# EAGLE schematic dw08aRev2 (EAGLE 6.6.0)

## Sheet 1 of 6
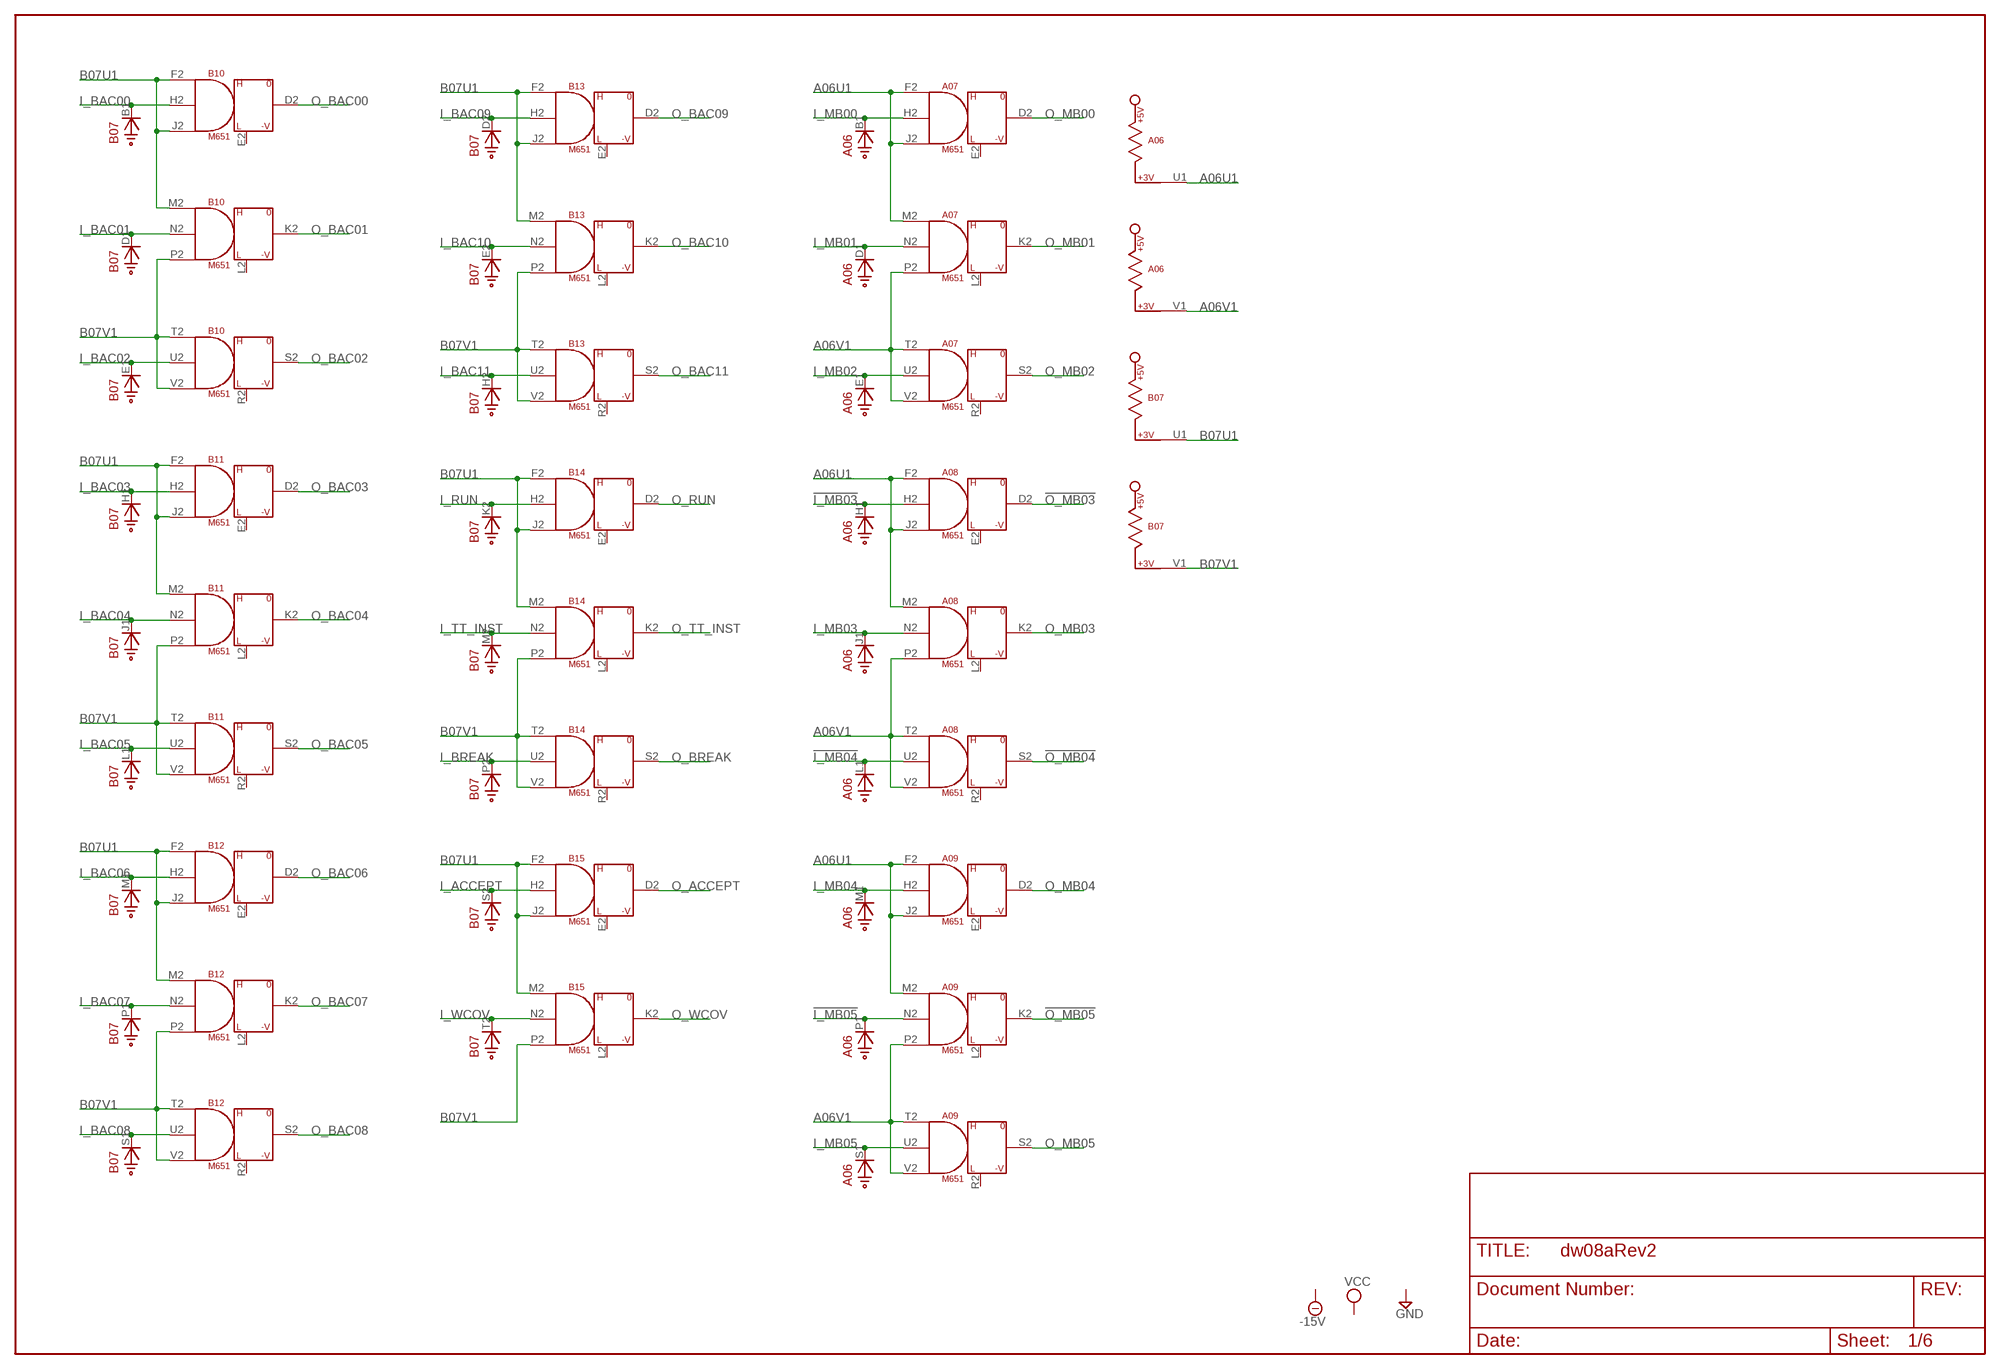
[diagram p0: schematic, sheet 1]

### Parts
A06  M907  [H807]
A07  M651  [H807]
A08  M651  [H807]
A09  M651  [H807]
B07  M907  [H807]
B10  M651  [H807]
B11  M651  [H807]
B12  M651  [H807]
B13  M651  [H807]
B14  M651  [H807]
B15  M651  [H807]

### Nets
!I_MB03: A06.H1(H1:CATHODE) A08.H2(D:IN2) ; also sheet 6
!I_MB04: A06.L1(L1:CATHODE) A08.U2(S:IN2) ; also sheet 6
!I_MB05: A06.P1(P1:CATHODE) A09.N2(K:IN2) ; also sheet 6
!O_MB03: A08.D2(D:OUT) ; also sheet 5
!O_MB04: A08.S2(S:OUT) ; also sheet 5
!O_MB05: A09.K2(K:OUT) ; also sheet 5
A06U1: A06.U1 A07.F2(D:IN1) A07.J2(D:IN3) A07.M2(K:IN1) A08.F2(D:IN1) A08.J2(D:IN3) A08.M2(K:IN1) A09.F2(D:IN1) A09.J2(D:IN3) A09.M2(K:IN1) ; also sheet 2
A06V1: A06.V1 A07.P2(K:IN3) A07.T2(S:IN1) A07.V2(S:IN3) A08.P2(K:IN3) A08.T2(S:IN1) A08.V2(S:IN3) A09.P2(K:IN3) A09.T2(S:IN1) A09.V2(S:IN3) ; also sheet 2
B07U1: B07.U1 B10.F2(D:IN1) B10.J2(D:IN3) B10.M2(K:IN1) B11.F2(D:IN1) B11.J2(D:IN3) B11.M2(K:IN1) B12.F2(D:IN1) B12.J2(D:IN3) B12.M2(K:IN1) B13.F2(D:IN1) B13.J2(D:IN3) B13.M2(K:IN1) B14.F2(D:IN1) B14.J2(D:IN3) B14.M2(K:IN1) B15.F2(D:IN1) B15.J2(D:IN3) B15.M2(K:IN1) ; also sheet 2
B07V1: B07.V1 B10.P2(K:IN3) B10.T2(S:IN1) B10.V2(S:IN3) B11.P2(K:IN3) B11.T2(S:IN1) B11.V2(S:IN3) B12.P2(K:IN3) B12.T2(S:IN1) B12.V2(S:IN3) B13.P2(K:IN3) B13.T2(S:IN1) B13.V2(S:IN3) B14.P2(K:IN3) B14.T2(S:IN1) B14.V2(S:IN3) B15.P2(K:IN3)
I_ACCEPT: B07.S2(S2:CATHODE) B15.H2(D:IN2) ; also sheet 6
I_BAC00: B07.B1(B1:CATHODE) B10.H2(D:IN2) ; also sheet 6
I_BAC01: B07.D1(D1:CATHODE) B10.N2(K:IN2) ; also sheet 6
I_BAC02: B07.E1(E1:CATHODE) B10.U2(S:IN2) ; also sheet 6
I_BAC03: B07.H1(H1:CATHODE) B11.H2(D:IN2) ; also sheet 6
I_BAC04: B07.J1(J1:CATHODE) B11.N2(K:IN2) ; also sheet 6
I_BAC05: B07.L1(L1:CATHODE) B11.U2(S:IN2) ; also sheet 6
I_BAC06: B07.M1(M1:CATHODE) B12.H2(D:IN2) ; also sheet 6
I_BAC07: B07.P1(P1:CATHODE) B12.N2(K:IN2) ; also sheet 6
I_BAC08: B07.S1(S1:CATHODE) B12.U2(S:IN2) ; also sheet 6
I_BAC09: B07.D2(D2:CATHODE) B13.H2(D:IN2) ; also sheet 6
I_BAC10: B07.E2(E2:CATHODE) B13.N2(K:IN2) ; also sheet 6
I_BAC11: B07.H2(H2:CATHODE) B13.U2(S:IN2) ; also sheet 6
I_BREAK: B07.P2(P2:CATHODE) B14.U2(S:IN2) ; also sheet 4,6
I_MB00: A06.B1(B1:CATHODE) A07.H2(D:IN2) ; also sheet 6
I_MB01: A06.D1(D1:CATHODE) A07.N2(K:IN2) ; also sheet 6
I_MB02: A06.E1(E1:CATHODE) A07.U2(S:IN2) ; also sheet 6
I_MB03: A06.J1(J1:CATHODE) A08.N2(K:IN2) ; also sheet 6
I_MB04: A06.M1(M1:CATHODE) A09.H2(D:IN2) ; also sheet 6
I_MB05: A06.S1(S1:CATHODE) A09.U2(S:IN2) ; also sheet 6
I_RUN: B07.K2(K2:CATHODE) B14.H2(D:IN2) ; also sheet 6
I_TT_INST: B07.M2(M2:CATHODE) B14.N2(K:IN2) ; also sheet 6
I_WCOV: B07.T2(T2:CATHODE) B15.N2(K:IN2) ; also sheet 6
O_ACCEPT: B15.D2(D:OUT) ; also sheet 5
O_BAC00: B10.D2(D:OUT) ; also sheet 5
O_BAC01: B10.K2(K:OUT) ; also sheet 5
O_BAC02: B10.S2(S:OUT) ; also sheet 5
O_BAC03: B11.D2(D:OUT) ; also sheet 5
O_BAC04: B11.K2(K:OUT) ; also sheet 5
O_BAC05: B11.S2(S:OUT) ; also sheet 5
O_BAC06: B12.D2(D:OUT) ; also sheet 5
O_BAC07: B12.K2(K:OUT) ; also sheet 5
O_BAC08: B12.S2(S:OUT) ; also sheet 5
O_BAC09: B13.D2(D:OUT) ; also sheet 5
O_BAC10: B13.K2(K:OUT) ; also sheet 5
O_BAC11: B13.S2(S:OUT) ; also sheet 5
O_BREAK: B14.S2(S:OUT) ; also sheet 5
O_MB00: A07.D2(D:OUT) ; also sheet 5
O_MB01: A07.K2(K:OUT) ; also sheet 5
O_MB02: A07.S2(S:OUT) ; also sheet 5
O_MB03: A08.K2(K:OUT) ; also sheet 5
O_MB04: A09.D2(D:OUT) ; also sheet 5
O_MB05: A09.S2(S:OUT) ; also sheet 5
O_RUN: B14.D2(D:OUT) ; also sheet 5
O_TT_INST: B14.K2(K:OUT) ; also sheet 5
O_WCOV: B15.K2(K:OUT) ; also sheet 5
Unconnected: A07.E2(D:SLOW) A07.L2(K:SLOW) A07.R2(S:SLOW) A08.E2(D:SLOW) A08.L2(K:SLOW) A08.R2(S:SLOW) A09.E2(D:SLOW) A09.L2(K:SLOW) A09.R2(S:SLOW) B07.V2(V2:CATHODE) B10.E2(D:SLOW) B10.L2(K:SLOW) B10.R2(S:SLOW) B11.E2(D:SLOW) B11.L2(K:SLOW) B11.R2(S:SLOW) B12.E2(D:SLOW) B12.L2(K:SLOW) B12.R2(S:SLOW) B13.E2(D:SLOW) B13.L2(K:SLOW) B13.R2(S:SLOW) B14.E2(D:SLOW) B14.L2(K:SLOW) B14.R2(S:SLOW) B15.E2(D:SLOW) B15.L2(K:SLOW) B15.R2(S:SLOW) B15.S2(S:OUT) B15.T2(S:IN1) B15.U2(S:IN2) B15.V2(S:IN3)

## Sheet 2 of 6
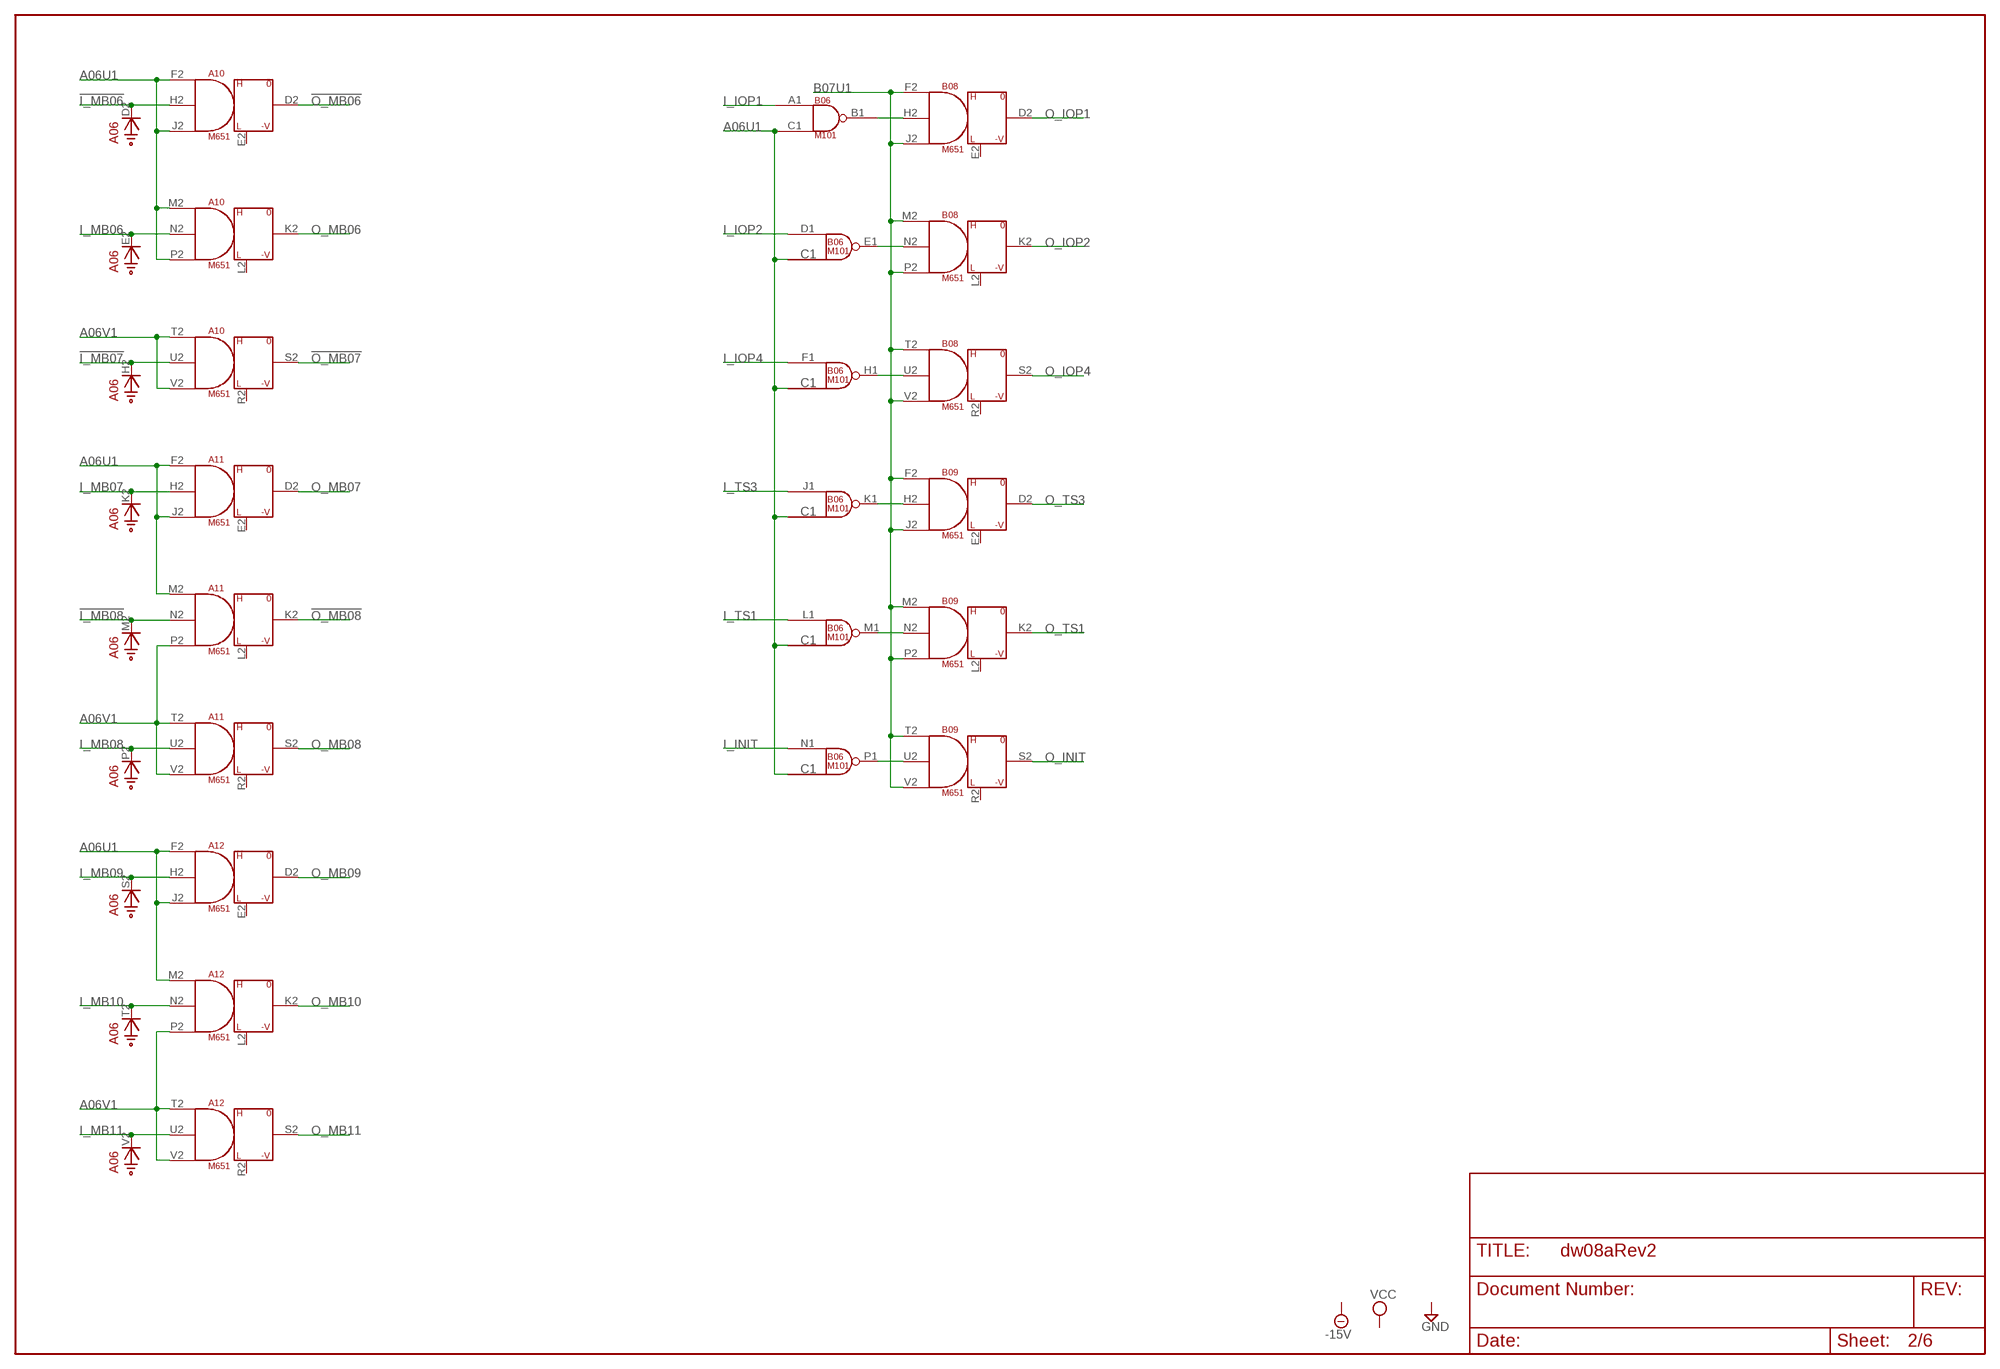
[diagram p1: schematic, sheet 2]

### Parts
A10  M651  [H807]
A11  M651  [H807]
A12  M651  [H807]
B06  M101  [H807]
B08  M651  [H807]
B09  M651  [H807]

### Nets
!I_MB06: A06.D2(D2:CATHODE) A10.H2(D:IN2) ; also sheet 6
!I_MB07: A06.H2(H2:CATHODE) A10.U2(S:IN2) ; also sheet 6
!I_MB08: A06.M2(M2:CATHODE) A11.N2(K:IN2) ; also sheet 6
!O_MB06: A10.D2(D:OUT) ; also sheet 5
!O_MB07: A10.S2(S:OUT) ; also sheet 5
!O_MB08: A11.K2(K:OUT) ; also sheet 5
A06U1: A10.F2(D:IN1) A10.J2(D:IN3) A10.M2(K:IN1) A10.P2(K:IN3) A11.F2(D:IN1) A11.J2(D:IN3) A11.M2(K:IN1) A12.F2(D:IN1) A12.J2(D:IN3) A12.M2(K:IN1) B06.C1(B1:IN2) ; also sheet 1
A06V1: A10.T2(S:IN1) A10.V2(S:IN3) A11.P2(K:IN3) A11.T2(S:IN1) A11.V2(S:IN3) A12.P2(K:IN3) A12.T2(S:IN1) A12.V2(S:IN3) ; also sheet 1
B07U1: B08.F2(D:IN1) B08.J2(D:IN3) B08.M2(K:IN1) B08.P2(K:IN3) B08.T2(S:IN1) B08.V2(S:IN3) B09.F2(D:IN1) B09.J2(D:IN3) B09.M2(K:IN1) B09.P2(K:IN3) B09.T2(S:IN1) B09.V2(S:IN3) ; also sheet 1
I_INIT: B06.N1(P1:IN) ; also sheet 6
I_IOP1: B06.A1(B1:IN1) ; also sheet 6
I_IOP2: B06.D1(E1:IN) ; also sheet 6
I_IOP4: B06.F1(H1:IN) ; also sheet 6
I_MB06: A06.E2(E2:CATHODE) A10.N2(K:IN2) ; also sheet 6
I_MB07: A06.K2(K2:CATHODE) A11.H2(D:IN2) ; also sheet 6
I_MB08: A06.P2(P2:CATHODE) A11.U2(S:IN2) ; also sheet 6
I_MB09: A06.S2(S2:CATHODE) A12.H2(D:IN2) ; also sheet 6
I_MB10: A06.T2(T2:CATHODE) A12.N2(K:IN2) ; also sheet 6
I_MB11: A06.V2(V2:CATHODE) A12.U2(S:IN2) ; also sheet 6
I_TS1: B06.L1(M1:IN) ; also sheet 6
I_TS3: B06.J1(K1:IN) ; also sheet 6
N$1: B06.B1(B1:OUT) B08.H2(D:IN2)
N$2: B06.E1(E1:OUT) B08.N2(K:IN2)
N$3: B06.H1(H1:OUT) B08.U2(S:IN2)
N$4: B06.K1(K1:OUT) B09.H2(D:IN2)
N$5: B06.M1(M1:OUT) B09.N2(K:IN2)
N$6: B06.P1(P1:OUT) B09.U2(S:IN2)
O_INIT: B09.S2(S:OUT) ; also sheet 5
O_IOP1: B08.D2(D:OUT) ; also sheet 5
O_IOP2: B08.K2(K:OUT) ; also sheet 5
O_IOP4: B08.S2(S:OUT) ; also sheet 5
O_MB06: A10.K2(K:OUT) ; also sheet 5
O_MB07: A11.D2(D:OUT) ; also sheet 5
O_MB08: A11.S2(S:OUT) ; also sheet 5
O_MB09: A12.D2(D:OUT) ; also sheet 5
O_MB10: A12.K2(K:OUT) ; also sheet 5
O_MB11: A12.S2(S:OUT) ; also sheet 5
O_TS1: B09.K2(K:OUT) ; also sheet 5
O_TS3: B09.D2(D:OUT) ; also sheet 5
Unconnected: A10.E2(D:SLOW) A10.L2(K:SLOW) A10.R2(S:SLOW) A11.E2(D:SLOW) A11.L2(K:SLOW) A11.R2(S:SLOW) A12.E2(D:SLOW) A12.L2(K:SLOW) A12.R2(S:SLOW) B06.E2(F2:IN) B06.F2(F2:OUT) B06.H2(J2:IN) B06.J2(J2:OUT) B06.K2(L2:IN) B06.L2(L2:OUT) B06.M2(N2:IN) B06.N2(N2:OUT) B06.P2(R2:IN) B06.R1(S1:IN) B06.R2(R2:OUT) B06.S1(S1:OUT) B06.S2(T2:IN) B06.T2(T2:OUT) B06.U1(U1:OUT) B06.U2(V2:IN) B06.V1(U1:IN) B06.V2(V2:OUT) B08.E2(D:SLOW) B08.L2(K:SLOW) B08.R2(S:SLOW) B09.E2(D:SLOW) B09.L2(K:SLOW) B09.R2(S:SLOW)

## Sheet 3 of 6
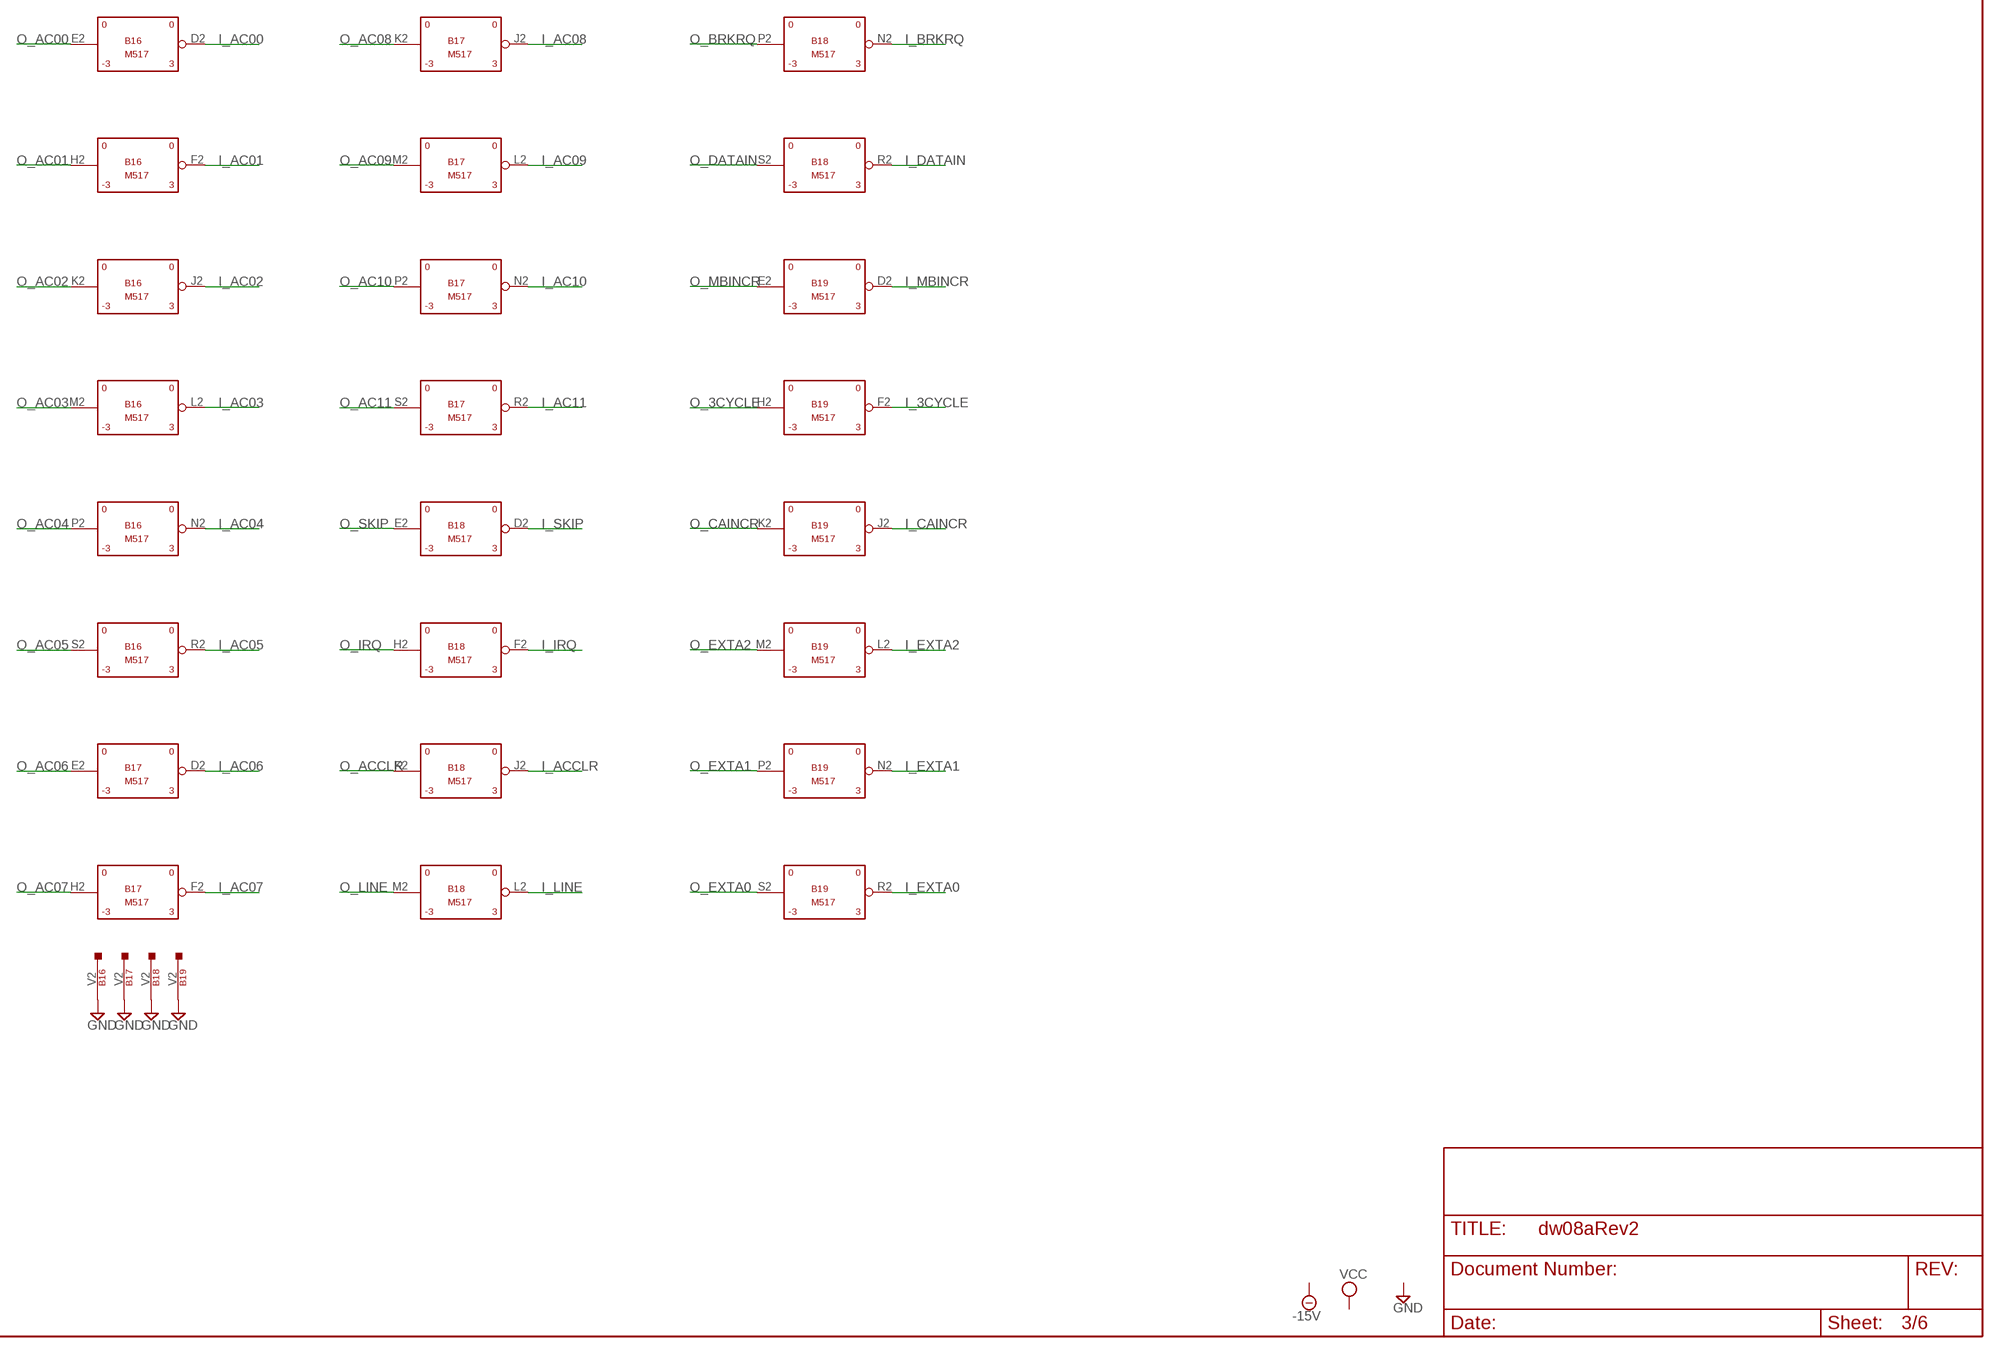
[diagram p2: schematic, sheet 3]

### Parts
B16  M517  [H807]
B17  M517  [H807]
B18  M517  [H807]
B19  M517  [H807]

### Nets
GND [supply]: B16.V2 B17.V2 B18.V2 B19.V2 ; also sheet 4
I_3CYCLE: B19.F2(F:OUT) ; also sheet 6
I_AC00: B16.D2(D:OUT) ; also sheet 6
I_AC01: B16.F2(F:OUT) ; also sheet 6
I_AC02: B16.J2(J:OUT) ; also sheet 6
I_AC03: B16.L2(L:OUT) ; also sheet 6
I_AC04: B16.N2(N:OUT) ; also sheet 6
I_AC05: B16.R2(R:OUT) ; also sheet 6
I_AC06: B17.D2(D:OUT) ; also sheet 6
I_AC07: B17.F2(F:OUT) ; also sheet 6
I_AC08: B17.J2(J:OUT) ; also sheet 6
I_AC09: B17.L2(L:OUT) ; also sheet 6
I_AC10: B17.N2(N:OUT) ; also sheet 6
I_AC11: B17.R2(R:OUT) ; also sheet 6
I_ACCLR: B18.J2(J:OUT) ; also sheet 6
I_BRKRQ: B18.N2(N:OUT) ; also sheet 6
I_CAINCR: B19.J2(J:OUT) ; also sheet 6
I_DATAIN: B18.R2(R:OUT) ; also sheet 6
I_EXTA0: B19.R2(R:OUT) ; also sheet 6
I_EXTA1: B19.N2(N:OUT) ; also sheet 6
I_EXTA2: B19.L2(L:OUT) ; also sheet 6
I_IRQ: B18.F2(F:OUT) ; also sheet 6
I_LINE: B18.L2(L:OUT) ; also sheet 6
I_MBINCR: B19.D2(D:OUT) ; also sheet 6
I_SKIP: B18.D2(D:OUT) ; also sheet 6
O_3CYCLE: B19.H2(F:IN) ; also sheet 5
O_AC00: B16.E2(D:IN) ; also sheet 5
O_AC01: B16.H2(F:IN) ; also sheet 5
O_AC02: B16.K2(J:IN) ; also sheet 5
O_AC03: B16.M2(L:IN) ; also sheet 5
O_AC04: B16.P2(N:IN) ; also sheet 5
O_AC05: B16.S2(R:IN) ; also sheet 5
O_AC06: B17.E2(D:IN) ; also sheet 5
O_AC07: B17.H2(F:IN) ; also sheet 5
O_AC08: B17.K2(J:IN) ; also sheet 5
O_AC09: B17.M2(L:IN) ; also sheet 5
O_AC10: B17.P2(N:IN) ; also sheet 5
O_AC11: B17.S2(R:IN) ; also sheet 5
O_ACCLR: B18.K2(J:IN) ; also sheet 5
O_BRKRQ: B18.P2(N:IN) ; also sheet 5
O_CAINCR: B19.K2(J:IN) ; also sheet 5
O_DATAIN: B18.S2(R:IN) ; also sheet 5
O_EXTA0: B19.S2(R:IN) ; also sheet 5
O_EXTA1: B19.P2(N:IN) ; also sheet 5
O_EXTA2: B19.M2(L:IN) ; also sheet 5
O_IRQ: B18.H2(F:IN) ; also sheet 5
O_LINE: B18.M2(L:IN) ; also sheet 5
O_MBINCR: B19.E2(D:IN) ; also sheet 5
O_SKIP: B18.E2(D:IN) ; also sheet 5

## Sheet 4 of 6
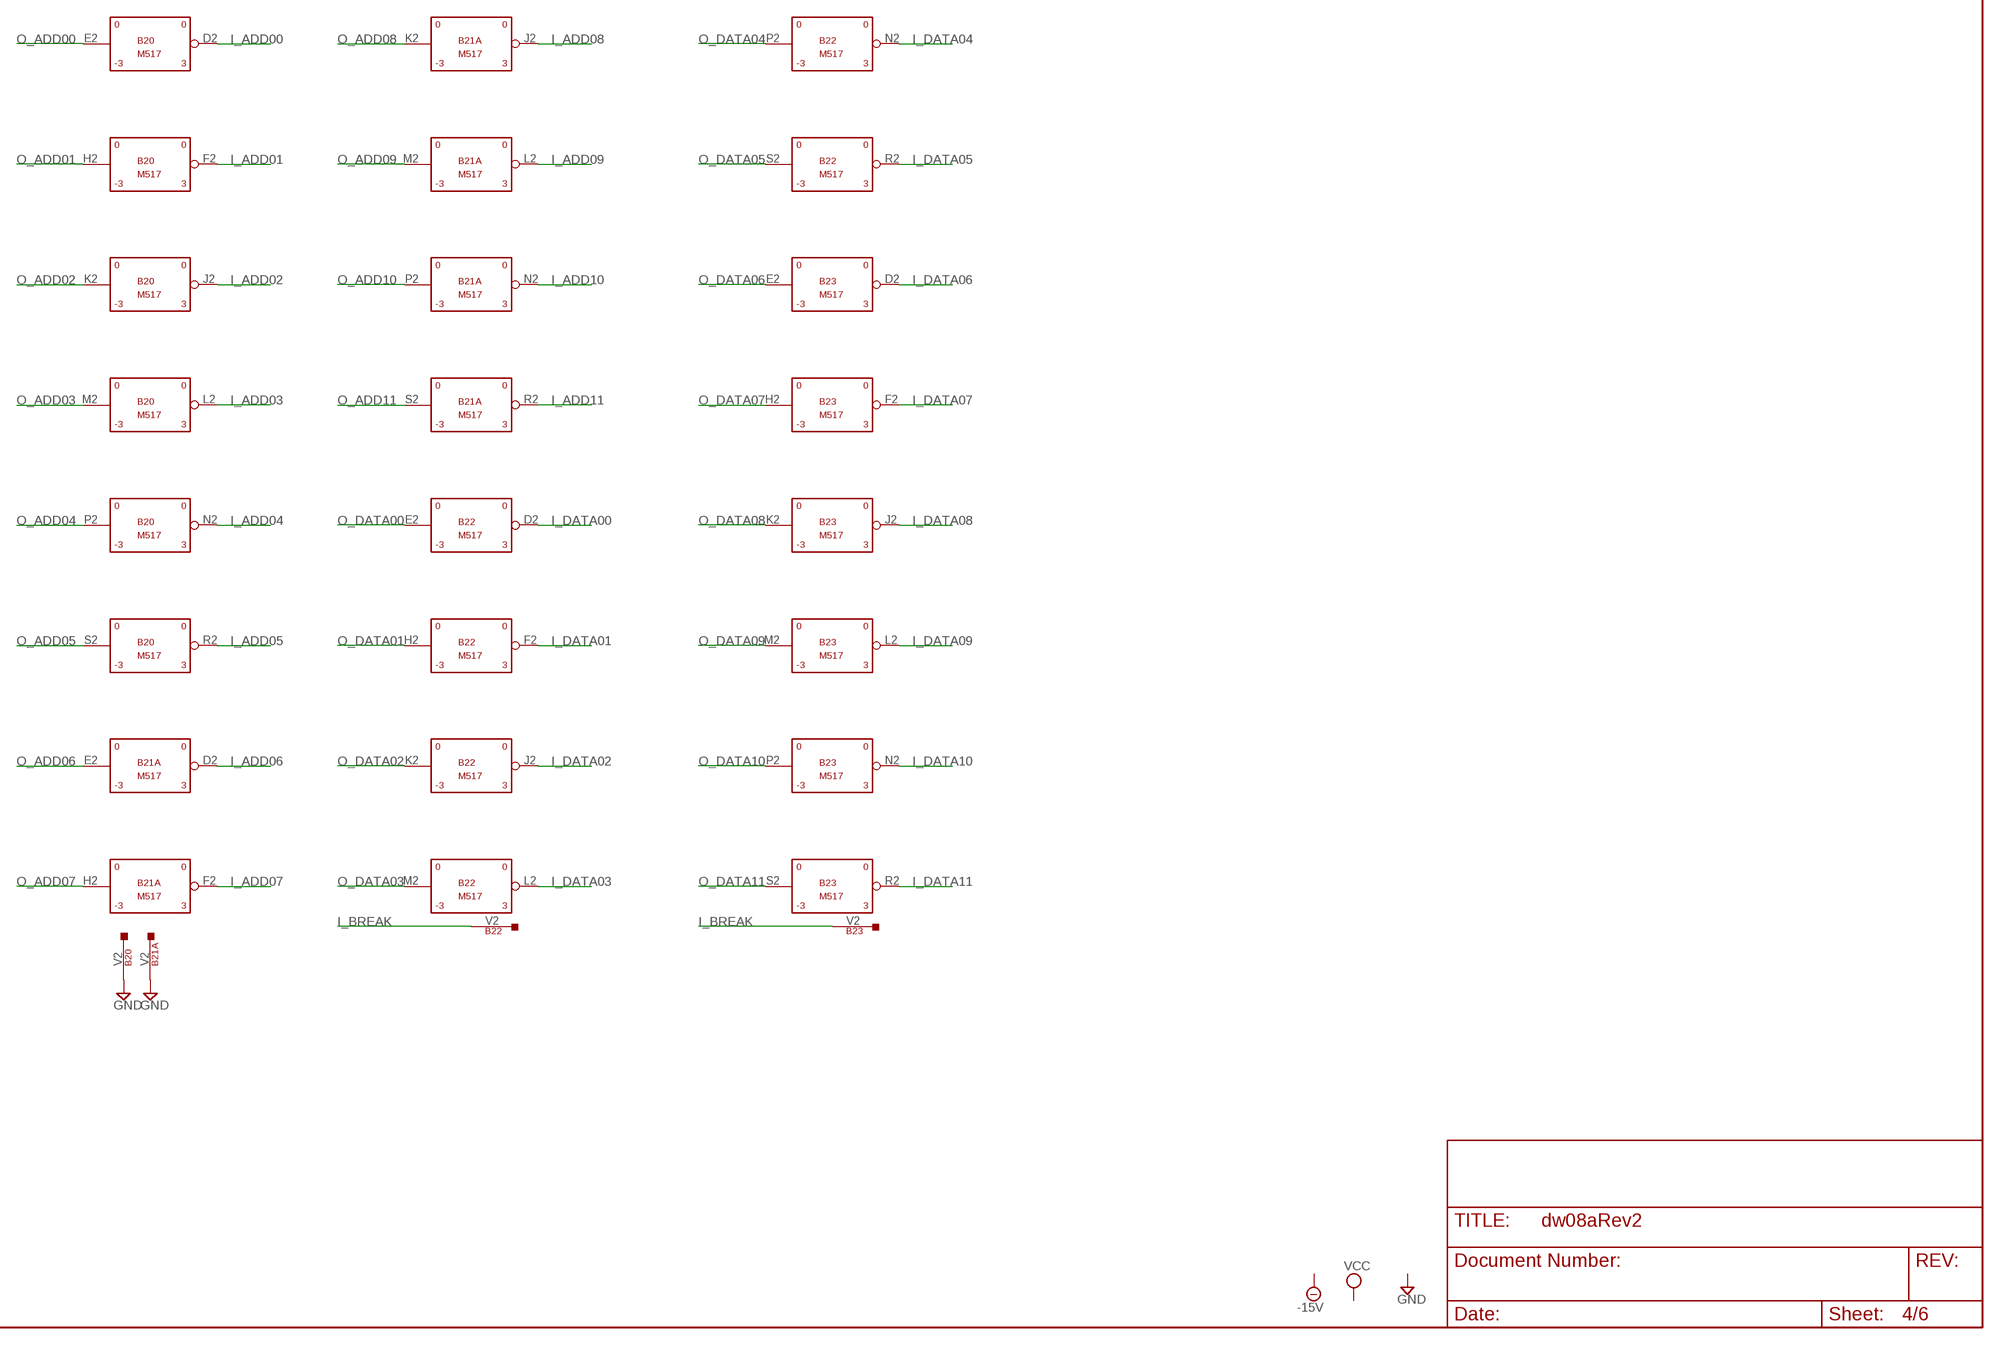
[diagram p3: schematic, sheet 4]

### Parts
B20  M517  [H807]
B21A  M517  [H807]
B22  M517  [H807]
B23  M517  [H807]

### Nets
GND [supply]: B20.V2 B21A.V2 ; also sheet 3
I_ADD00: B20.D2(D:OUT) ; also sheet 6
I_ADD01: B20.F2(F:OUT) ; also sheet 6
I_ADD02: B20.J2(J:OUT) ; also sheet 6
I_ADD03: B20.L2(L:OUT) ; also sheet 6
I_ADD04: B20.N2(N:OUT) ; also sheet 6
I_ADD05: B20.R2(R:OUT) ; also sheet 6
I_ADD06: B21A.D2(D:OUT) ; also sheet 6
I_ADD07: B21A.F2(F:OUT) ; also sheet 6
I_ADD08: B21A.J2(J:OUT) ; also sheet 6
I_ADD09: B21A.L2(L:OUT) ; also sheet 6
I_ADD10: B21A.N2(N:OUT) ; also sheet 6
I_ADD11: B21A.R2(R:OUT) ; also sheet 6
I_BREAK: B22.V2 B23.V2 ; also sheet 1,6
I_DATA00: B22.D2(D:OUT) ; also sheet 6
I_DATA01: B22.F2(F:OUT) ; also sheet 6
I_DATA02: B22.J2(J:OUT) ; also sheet 6
I_DATA03: B22.L2(L:OUT) ; also sheet 6
I_DATA04: B22.N2(N:OUT) ; also sheet 6
I_DATA05: B22.R2(R:OUT) ; also sheet 6
I_DATA06: B23.D2(D:OUT) ; also sheet 6
I_DATA07: B23.F2(F:OUT) ; also sheet 6
I_DATA08: B23.J2(J:OUT) ; also sheet 6
I_DATA09: B23.L2(L:OUT) ; also sheet 6
I_DATA10: B23.N2(N:OUT) ; also sheet 6
I_DATA11: B23.R2(R:OUT) ; also sheet 6
O_ADD00: B20.E2(D:IN) ; also sheet 5
O_ADD01: B20.H2(F:IN) ; also sheet 5
O_ADD02: B20.K2(J:IN) ; also sheet 5
O_ADD03: B20.M2(L:IN) ; also sheet 5
O_ADD04: B20.P2(N:IN) ; also sheet 5
O_ADD05: B20.S2(R:IN) ; also sheet 5
O_ADD06: B21A.E2(D:IN) ; also sheet 5
O_ADD07: B21A.H2(F:IN) ; also sheet 5
O_ADD08: B21A.K2(J:IN) ; also sheet 5
O_ADD09: B21A.M2(L:IN) ; also sheet 5
O_ADD10: B21A.P2(N:IN) ; also sheet 5
O_ADD11: B21A.S2(R:IN) ; also sheet 5
O_DATA00: B22.E2(D:IN) ; also sheet 5
O_DATA01: B22.H2(F:IN) ; also sheet 5
O_DATA02: B22.K2(J:IN) ; also sheet 5
O_DATA03: B22.M2(L:IN) ; also sheet 5
O_DATA04: B22.P2(N:IN) ; also sheet 5
O_DATA05: B22.S2(R:IN) ; also sheet 5
O_DATA06: B23.E2(D:IN) ; also sheet 5
O_DATA07: B23.H2(F:IN) ; also sheet 5
O_DATA08: B23.K2(J:IN) ; also sheet 5
O_DATA09: B23.M2(L:IN) ; also sheet 5
O_DATA10: B23.P2(N:IN) ; also sheet 5
O_DATA11: B23.S2(R:IN) ; also sheet 5

## Sheet 5 of 6
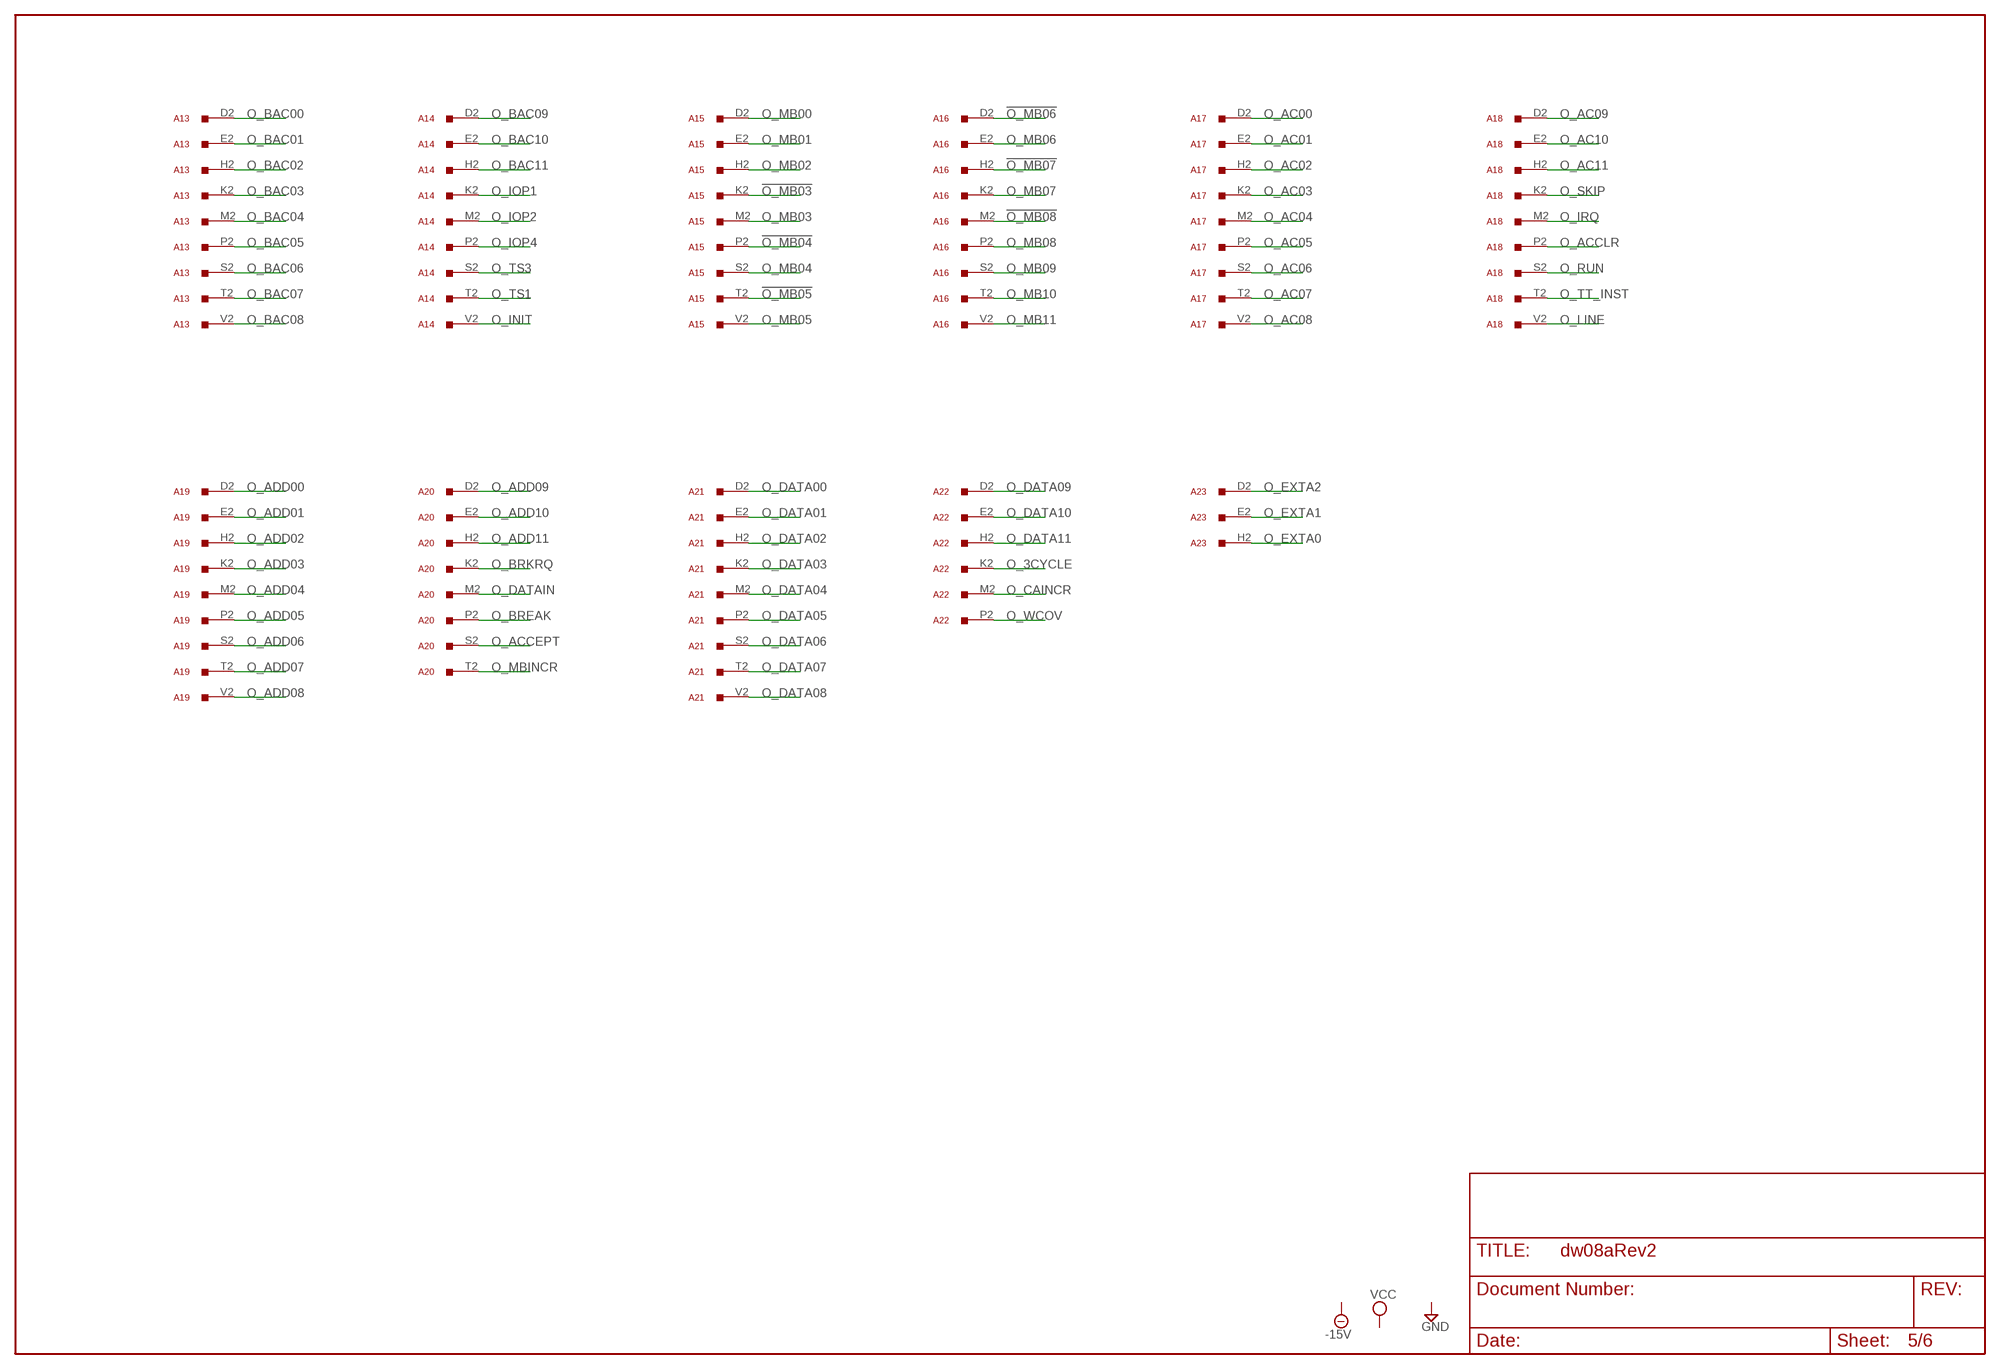
[diagram p4: schematic, sheet 5]

### Parts
A13  W011  [H807]
A14  W011  [H807]
A15  W011  [H807]
A16  W011  [H807]
A17  W011  [H807]
A18  W011  [H807]
A19  W011  [H807]
A20  W011  [H807]
A21  W011  [H807]
A22  W011  [H807]
A23  W011  [H807]

### Nets
!O_MB03: A15.K2 ; also sheet 1
!O_MB04: A15.P2 ; also sheet 1
!O_MB05: A15.T2 ; also sheet 1
!O_MB06: A16.D2 ; also sheet 2
!O_MB07: A16.H2 ; also sheet 2
!O_MB08: A16.M2 ; also sheet 2
O_3CYCLE: A22.K2 ; also sheet 3
O_AC00: A17.D2 ; also sheet 3
O_AC01: A17.E2 ; also sheet 3
O_AC02: A17.H2 ; also sheet 3
O_AC03: A17.K2 ; also sheet 3
O_AC04: A17.M2 ; also sheet 3
O_AC05: A17.P2 ; also sheet 3
O_AC06: A17.S2 ; also sheet 3
O_AC07: A17.T2 ; also sheet 3
O_AC08: A17.V2 ; also sheet 3
O_AC09: A18.D2 ; also sheet 3
O_AC10: A18.E2 ; also sheet 3
O_AC11: A18.H2 ; also sheet 3
O_ACCEPT: A20.S2 ; also sheet 1
O_ACCLR: A18.P2 ; also sheet 3
O_ADD00: A19.D2 ; also sheet 4
O_ADD01: A19.E2 ; also sheet 4
O_ADD02: A19.H2 ; also sheet 4
O_ADD03: A19.K2 ; also sheet 4
O_ADD04: A19.M2 ; also sheet 4
O_ADD05: A19.P2 ; also sheet 4
O_ADD06: A19.S2 ; also sheet 4
O_ADD07: A19.T2 ; also sheet 4
O_ADD08: A19.V2 ; also sheet 4
O_ADD09: A20.D2 ; also sheet 4
O_ADD10: A20.E2 ; also sheet 4
O_ADD11: A20.H2 ; also sheet 4
O_BAC00: A13.D2 ; also sheet 1
O_BAC01: A13.E2 ; also sheet 1
O_BAC02: A13.H2 ; also sheet 1
O_BAC03: A13.K2 ; also sheet 1
O_BAC04: A13.M2 ; also sheet 1
O_BAC05: A13.P2 ; also sheet 1
O_BAC06: A13.S2 ; also sheet 1
O_BAC07: A13.T2 ; also sheet 1
O_BAC08: A13.V2 ; also sheet 1
O_BAC09: A14.D2 ; also sheet 1
O_BAC10: A14.E2 ; also sheet 1
O_BAC11: A14.H2 ; also sheet 1
O_BREAK: A20.P2 ; also sheet 1
O_BRKRQ: A20.K2 ; also sheet 3
O_CAINCR: A22.M2 ; also sheet 3
O_DATA00: A21.D2 ; also sheet 4
O_DATA01: A21.E2 ; also sheet 4
O_DATA02: A21.H2 ; also sheet 4
O_DATA03: A21.K2 ; also sheet 4
O_DATA04: A21.M2 ; also sheet 4
O_DATA05: A21.P2 ; also sheet 4
O_DATA06: A21.S2 ; also sheet 4
O_DATA07: A21.T2 ; also sheet 4
O_DATA08: A21.V2 ; also sheet 4
O_DATA09: A22.D2 ; also sheet 4
O_DATA10: A22.E2 ; also sheet 4
O_DATA11: A22.H2 ; also sheet 4
O_DATAIN: A20.M2 ; also sheet 3
O_EXTA0: A23.H2 ; also sheet 3
O_EXTA1: A23.E2 ; also sheet 3
O_EXTA2: A23.D2 ; also sheet 3
O_INIT: A14.V2 ; also sheet 2
O_IOP1: A14.K2 ; also sheet 2
O_IOP2: A14.M2 ; also sheet 2
O_IOP4: A14.P2 ; also sheet 2
O_IRQ: A18.M2 ; also sheet 3
O_LINE: A18.V2 ; also sheet 3
O_MB00: A15.D2 ; also sheet 1
O_MB01: A15.E2 ; also sheet 1
O_MB02: A15.H2 ; also sheet 1
O_MB03: A15.M2 ; also sheet 1
O_MB04: A15.S2 ; also sheet 1
O_MB05: A15.V2 ; also sheet 1
O_MB06: A16.E2 ; also sheet 2
O_MB07: A16.K2 ; also sheet 2
O_MB08: A16.P2 ; also sheet 2
O_MB09: A16.S2 ; also sheet 2
O_MB10: A16.T2 ; also sheet 2
O_MB11: A16.V2 ; also sheet 2
O_MBINCR: A20.T2 ; also sheet 3
O_RUN: A18.S2 ; also sheet 1
O_SKIP: A18.K2 ; also sheet 3
O_TS1: A14.T2 ; also sheet 2
O_TS3: A14.S2 ; also sheet 2
O_TT_INST: A18.T2 ; also sheet 1
O_WCOV: A22.P2 ; also sheet 1
Unconnected: A20.V2 A22.S2 A22.T2 A22.V2 A23.K2 A23.M2 A23.P2 A23.S2 A23.T2 A23.V2

## Sheet 6 of 6
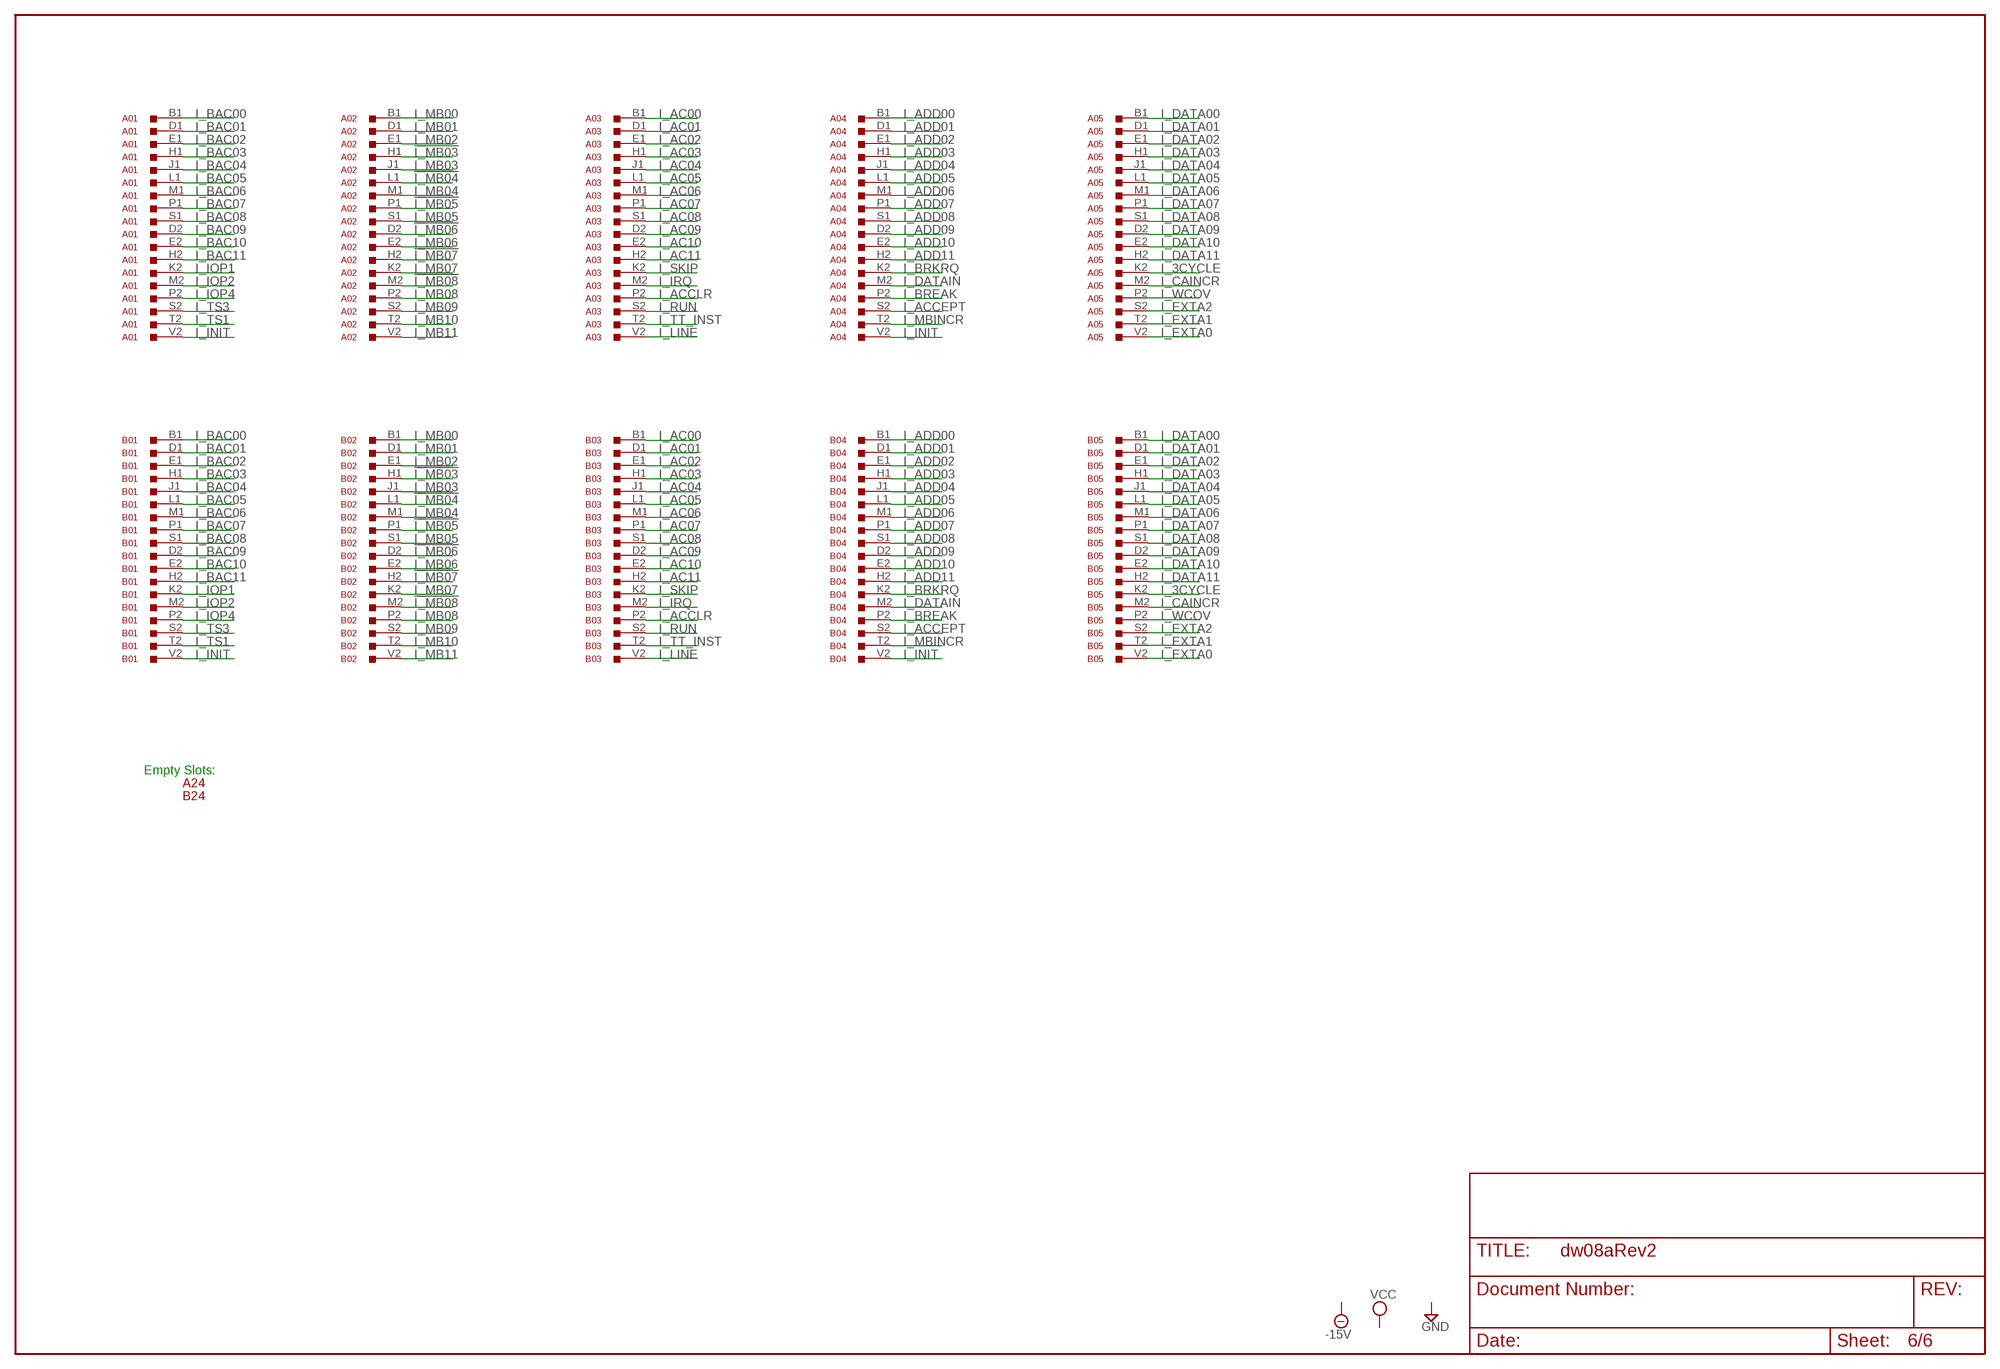
[diagram p5: schematic, sheet 6]

### Parts
A01  M903  [H807]
A02  M903  [H807]
A03  M903  [H807]
A04  M903  [H807]
A05  M903  [H807]
A24  H807  [H807]
B01  M903  [H807]
B02  M903  [H807]
B03  M903  [H807]
B04  M903  [H807]
B05  M903  [H807]
B24  H807  [H807]

### Nets
!I_MB03: A02.H1 B02.H1 ; also sheet 1
!I_MB04: A02.L1 B02.L1 ; also sheet 1
!I_MB05: A02.P1 B02.P1 ; also sheet 1
!I_MB06: A02.D2 B02.D2 ; also sheet 2
!I_MB07: A02.H2 B02.H2 ; also sheet 2
!I_MB08: A02.M2 B02.M2 ; also sheet 2
I_3CYCLE: A05.K2 B05.K2 ; also sheet 3
I_AC00: A03.B1 B03.B1 ; also sheet 3
I_AC01: A03.D1 B03.D1 ; also sheet 3
I_AC02: A03.E1 B03.E1 ; also sheet 3
I_AC03: A03.H1 B03.H1 ; also sheet 3
I_AC04: A03.J1 B03.J1 ; also sheet 3
I_AC05: A03.L1 B03.L1 ; also sheet 3
I_AC06: A03.M1 B03.M1 ; also sheet 3
I_AC07: A03.P1 B03.P1 ; also sheet 3
I_AC08: A03.S1 B03.S1 ; also sheet 3
I_AC09: A03.D2 B03.D2 ; also sheet 3
I_AC10: A03.E2 B03.E2 ; also sheet 3
I_AC11: A03.H2 B03.H2 ; also sheet 3
I_ACCEPT: A04.S2 B04.S2 ; also sheet 1
I_ACCLR: A03.P2 B03.P2 ; also sheet 3
I_ADD00: A04.B1 B04.B1 ; also sheet 4
I_ADD01: A04.D1 B04.D1 ; also sheet 4
I_ADD02: A04.E1 B04.E1 ; also sheet 4
I_ADD03: A04.H1 B04.H1 ; also sheet 4
I_ADD04: A04.J1 B04.J1 ; also sheet 4
I_ADD05: A04.L1 B04.L1 ; also sheet 4
I_ADD06: A04.M1 B04.M1 ; also sheet 4
I_ADD07: A04.P1 B04.P1 ; also sheet 4
I_ADD08: A04.S1 B04.S1 ; also sheet 4
I_ADD09: A04.D2 B04.D2 ; also sheet 4
I_ADD10: A04.E2 B04.E2 ; also sheet 4
I_ADD11: A04.H2 B04.H2 ; also sheet 4
I_BAC00: A01.B1 B01.B1 ; also sheet 1
I_BAC01: A01.D1 B01.D1 ; also sheet 1
I_BAC02: A01.E1 B01.E1 ; also sheet 1
I_BAC03: A01.H1 B01.H1 ; also sheet 1
I_BAC04: A01.J1 B01.J1 ; also sheet 1
I_BAC05: A01.L1 B01.L1 ; also sheet 1
I_BAC06: A01.M1 B01.M1 ; also sheet 1
I_BAC07: A01.P1 B01.P1 ; also sheet 1
I_BAC08: A01.S1 B01.S1 ; also sheet 1
I_BAC09: A01.D2 B01.D2 ; also sheet 1
I_BAC10: A01.E2 B01.E2 ; also sheet 1
I_BAC11: A01.H2 B01.H2 ; also sheet 1
I_BREAK: A04.P2 B04.P2 ; also sheet 1,4
I_BRKRQ: A04.K2 B04.K2 ; also sheet 3
I_CAINCR: A05.M2 B05.M2 ; also sheet 3
I_DATA00: A05.B1 B05.B1 ; also sheet 4
I_DATA01: A05.D1 B05.D1 ; also sheet 4
I_DATA02: A05.E1 B05.E1 ; also sheet 4
I_DATA03: A05.H1 B05.H1 ; also sheet 4
I_DATA04: A05.J1 B05.J1 ; also sheet 4
I_DATA05: A05.L1 B05.L1 ; also sheet 4
I_DATA06: A05.M1 B05.M1 ; also sheet 4
I_DATA07: A05.P1 B05.P1 ; also sheet 4
I_DATA08: A05.S1 B05.S1 ; also sheet 4
I_DATA09: A05.D2 B05.D2 ; also sheet 4
I_DATA10: A05.E2 B05.E2 ; also sheet 4
I_DATA11: A05.H2 B05.H2 ; also sheet 4
I_DATAIN: A04.M2 B04.M2 ; also sheet 3
I_EXTA0: A05.V2 B05.V2 ; also sheet 3
I_EXTA1: A05.T2 B05.T2 ; also sheet 3
I_EXTA2: A05.S2 B05.S2 ; also sheet 3
I_INIT: A01.V2 A04.V2 B01.V2 B04.V2 ; also sheet 2
I_IOP1: A01.K2 B01.K2 ; also sheet 2
I_IOP2: A01.M2 B01.M2 ; also sheet 2
I_IOP4: A01.P2 B01.P2 ; also sheet 2
I_IRQ: A03.M2 B03.M2 ; also sheet 3
I_LINE: A03.V2 B03.V2 ; also sheet 3
I_MB00: A02.B1 B02.B1 ; also sheet 1
I_MB01: A02.D1 B02.D1 ; also sheet 1
I_MB02: A02.E1 B02.E1 ; also sheet 1
I_MB03: A02.J1 B02.J1 ; also sheet 1
I_MB04: A02.M1 B02.M1 ; also sheet 1
I_MB05: A02.S1 B02.S1 ; also sheet 1
I_MB06: A02.E2 B02.E2 ; also sheet 2
I_MB07: A02.K2 B02.K2 ; also sheet 2
I_MB08: A02.P2 B02.P2 ; also sheet 2
I_MB09: A02.S2 B02.S2 ; also sheet 2
I_MB10: A02.T2 B02.T2 ; also sheet 2
I_MB11: A02.V2 B02.V2 ; also sheet 2
I_MBINCR: A04.T2 B04.T2 ; also sheet 3
I_RUN: A03.S2 B03.S2 ; also sheet 1
I_SKIP: A03.K2 B03.K2 ; also sheet 3
I_TS1: A01.T2 B01.T2 ; also sheet 2
I_TS3: A01.S2 B01.S2 ; also sheet 2
I_TT_INST: A03.T2 B03.T2 ; also sheet 1
I_WCOV: A05.P2 B05.P2 ; also sheet 1

### Notes on the sheet
- Empty Slots:

## Power pins joined to a net without a drawn wire
-15V: A07.B2(-15V) A08.B2(-15V) A09.B2(-15V) A10.B2(-15V) A11.B2(-15V) A12.B2(-15V) B08.B2(-15V) B09.B2(-15V) B10.B2(-15V) B11.B2(-15V) B12.B2(-15V) B13.B2(-15V) B14.B2(-15V) B15.B2(-15V) B16.B2(B:-15V) B17.B2(B:-15V) B18.B2(B:-15V) B19.B2(B:-15V) B20.B2(B:-15V) B21A.B2(B:-15V) B22.B2(B:-15V) B23.B2(B:-15V)
GND: A01.A1 A01.C1 A01.C2 A01.F1 A01.F2 A01.J2 A01.K1 A01.L2 A01.N1 A01.N2 A01.R1 A01.R2 A01.T1 A01.U2 A02.A1 A02.C1 A02.C2 A02.F1 A02.F2 A02.J2 A02.K1 A02.L2 A02.N1 A02.N2 A02.R1 A02.R2 A02.T1 A02.U2 A03.A1 A03.C1 A03.C2 A03.F1 A03.F2 A03.J2 A03.K1 A03.L2 A03.N1 A03.N2 A03.R1 A03.R2 A03.T1 A03.U2 A04.A1 A04.C1 A04.C2 A04.F1 A04.F2 A04.J2 A04.K1 A04.L2 A04.N1 A04.N2 A04.R1 A04.R2 A04.T1 A04.U2 A05.A1 A05.C1 A05.C2 A05.F1 A05.F2 A05.J2 A05.K1 A05.L2 A05.N1 A05.N2 A05.R1 A05.R2 A05.T1 A05.U2 A06.A1(A1:GND) A06.C1(C1:GND) A06.C2(GND) A06.F1(F1:GND) A06.F2(F2:GND) A06.J2(J2:GND) A06.K1(K1:GND) A06.L2(L2:GND) A06.N1(N1:GND) A06.N2(N2:GND) A06.R1(R1:GND) A06.R2(R2:GND) A06.T1(T1:GND) A06.U2(U2:GND) A07.C2(GND) A08.C2(GND) A09.C2(GND) A10.C2(GND) A11.C2(GND) A12.C2(GND) A13.C2 A13.F2 A13.J2 A13.L2 A13.N2 A13.R2 A13.U2 A14.C2 A14.F2 A14.J2 A14.L2 A14.N2 A14.R2 A14.U2 A15.C2 A15.F2 A15.J2 A15.L2 A15.N2 A15.R2 A15.U2 A16.C2 A16.F2 A16.J2 A16.L2 A16.N2 A16.R2 A16.U2 A17.C2 A17.F2 A17.J2 A17.L2 A17.N2 A17.R2 A17.U2 A18.C2 A18.F2 A18.J2 A18.L2 A18.N2 A18.R2 A18.U2 A19.C2 A19.F2 A19.J2 A19.L2 A19.N2 A19.R2 A19.U2 A20.C2 A20.F2 A20.J2 A20.L2 A20.N2 A20.R2 A20.U2 A21.C2 A21.F2 A21.J2 A21.L2 A21.N2 A21.R2 A21.U2 A22.C2 A22.F2 A22.J2 A22.L2 A22.N2 A22.R2 A22.U2 A23.C2 A23.F2 A23.J2 A23.L2 A23.N2 A23.R2 A23.U2 B01.A1 B01.C1 B01.C2 B01.F1 B01.F2 B01.J2 B01.K1 B01.L2 B01.N1 B01.N2 B01.R1 B01.R2 B01.T1 B01.U2 B02.A1 B02.C1 B02.C2 B02.F1 B02.F2 B02.J2 B02.K1 B02.L2 B02.N1 B02.N2 B02.R1 B02.R2 B02.T1 B02.U2 B03.A1 B03.C1 B03.C2 B03.F1 B03.F2 B03.J2 B03.K1 B03.L2 B03.N1 B03.N2 B03.R1 B03.R2 B03.T1 B03.U2 B04.A1 B04.C1 B04.C2 B04.F1 B04.F2 B04.J2 B04.K1 B04.L2 B04.N1 B04.N2 B04.R1 B04.R2 B04.T1 B04.U2 B05.A1 B05.C1 B05.C2 B05.F1 B05.F2 B05.J2 B05.K1 B05.L2 B05.N1 B05.N2 B05.R1 B05.R2 B05.T1 B05.U2 B06.C2(GND) B06.T1(GND) B07.A1(A1:GND) B07.C1(C1:GND) B07.C2(GND) B07.F1(F1:GND) B07.F2(F2:GND) B07.J2(J2:GND) B07.K1(K1:GND) B07.L2(L2:GND) B07.N1(N1:GND) B07.N2(N2:GND) B07.R1(R1:GND) B07.R2(R2:GND) B07.T1(T1:GND) B07.U2(U2:GND) B08.C2(GND) B09.C2(GND) B10.C2(GND) B11.C2(GND) B12.C2(GND) B13.C2(GND) B14.C2(GND) B15.C2(GND) B16.C2(C2:GND) B16.T2(T:GND) B16.U2(U:GND) B17.C2(C2:GND) B17.T2(T:GND) B17.U2(U:GND) B18.C2(C2:GND) B18.T2(T:GND) B18.U2(U:GND) B19.C2(C2:GND) B19.T2(T:GND) B19.U2(U:GND) B20.C2(C2:GND) B20.T2(T:GND) B20.U2(U:GND) B21A.C2(C2:GND) B21A.T2(T:GND) B21A.U2(U:GND) B22.C2(C2:GND) B22.T2(T:GND) B22.U2(U:GND) B23.C2(C2:GND) B23.T2(T:GND) B23.U2(U:GND)
VCC: A06.A2(VCC) A07.A2(VCC) A08.A2(VCC) A09.A2(VCC) A10.A2(VCC) A11.A2(VCC) A12.A2(VCC) B06.A2(VCC) B07.A2(VCC) B08.A2(VCC) B09.A2(VCC) B10.A2(VCC) B11.A2(VCC) B12.A2(VCC) B13.A2(VCC) B14.A2(VCC) B15.A2(VCC) B16.A2(C2:VCC) B17.A2(C2:VCC) B18.A2(C2:VCC) B19.A2(C2:VCC) B20.A2(C2:VCC) B21A.A2(C2:VCC) B22.A2(C2:VCC) B23.A2(C2:VCC)

## Library data of the parts
A01-A05 B01-B05 = dec-m:M903: Two-sided Posibus cable/connector.
A06 B07 = dec-m:M907: M907 Diode Clamp
A07-A09 A10-A12 B08 B09 B10-B15 = dec-m:M651: M651 - Negative Output Converter
A13-A23 = dec-m:W011: One-sided 9 pin connector/cable with grounds (Negibus).
A24 B24 = dec-m:H807: Empty card slot
B06 = dec-m:M101: Bus Data Interface The M101 contains 15 two-input NAND gates. One input of each gate is tied to a common line so that all data signals can be enabled simultaneously. Each data signal presents one TTL load. The common input presents 15 loads. Each output can drive 10 loads. Power: 5V@82ma (max.)
B16-B20 B21A B22 B23 = dec-m:M517: M517 Negative Bus Converter

## Net classes
1 supply: width 0.381 mm